# Altium schematic sheet PAGE1 - CONTENTS.SchDoc
size A3
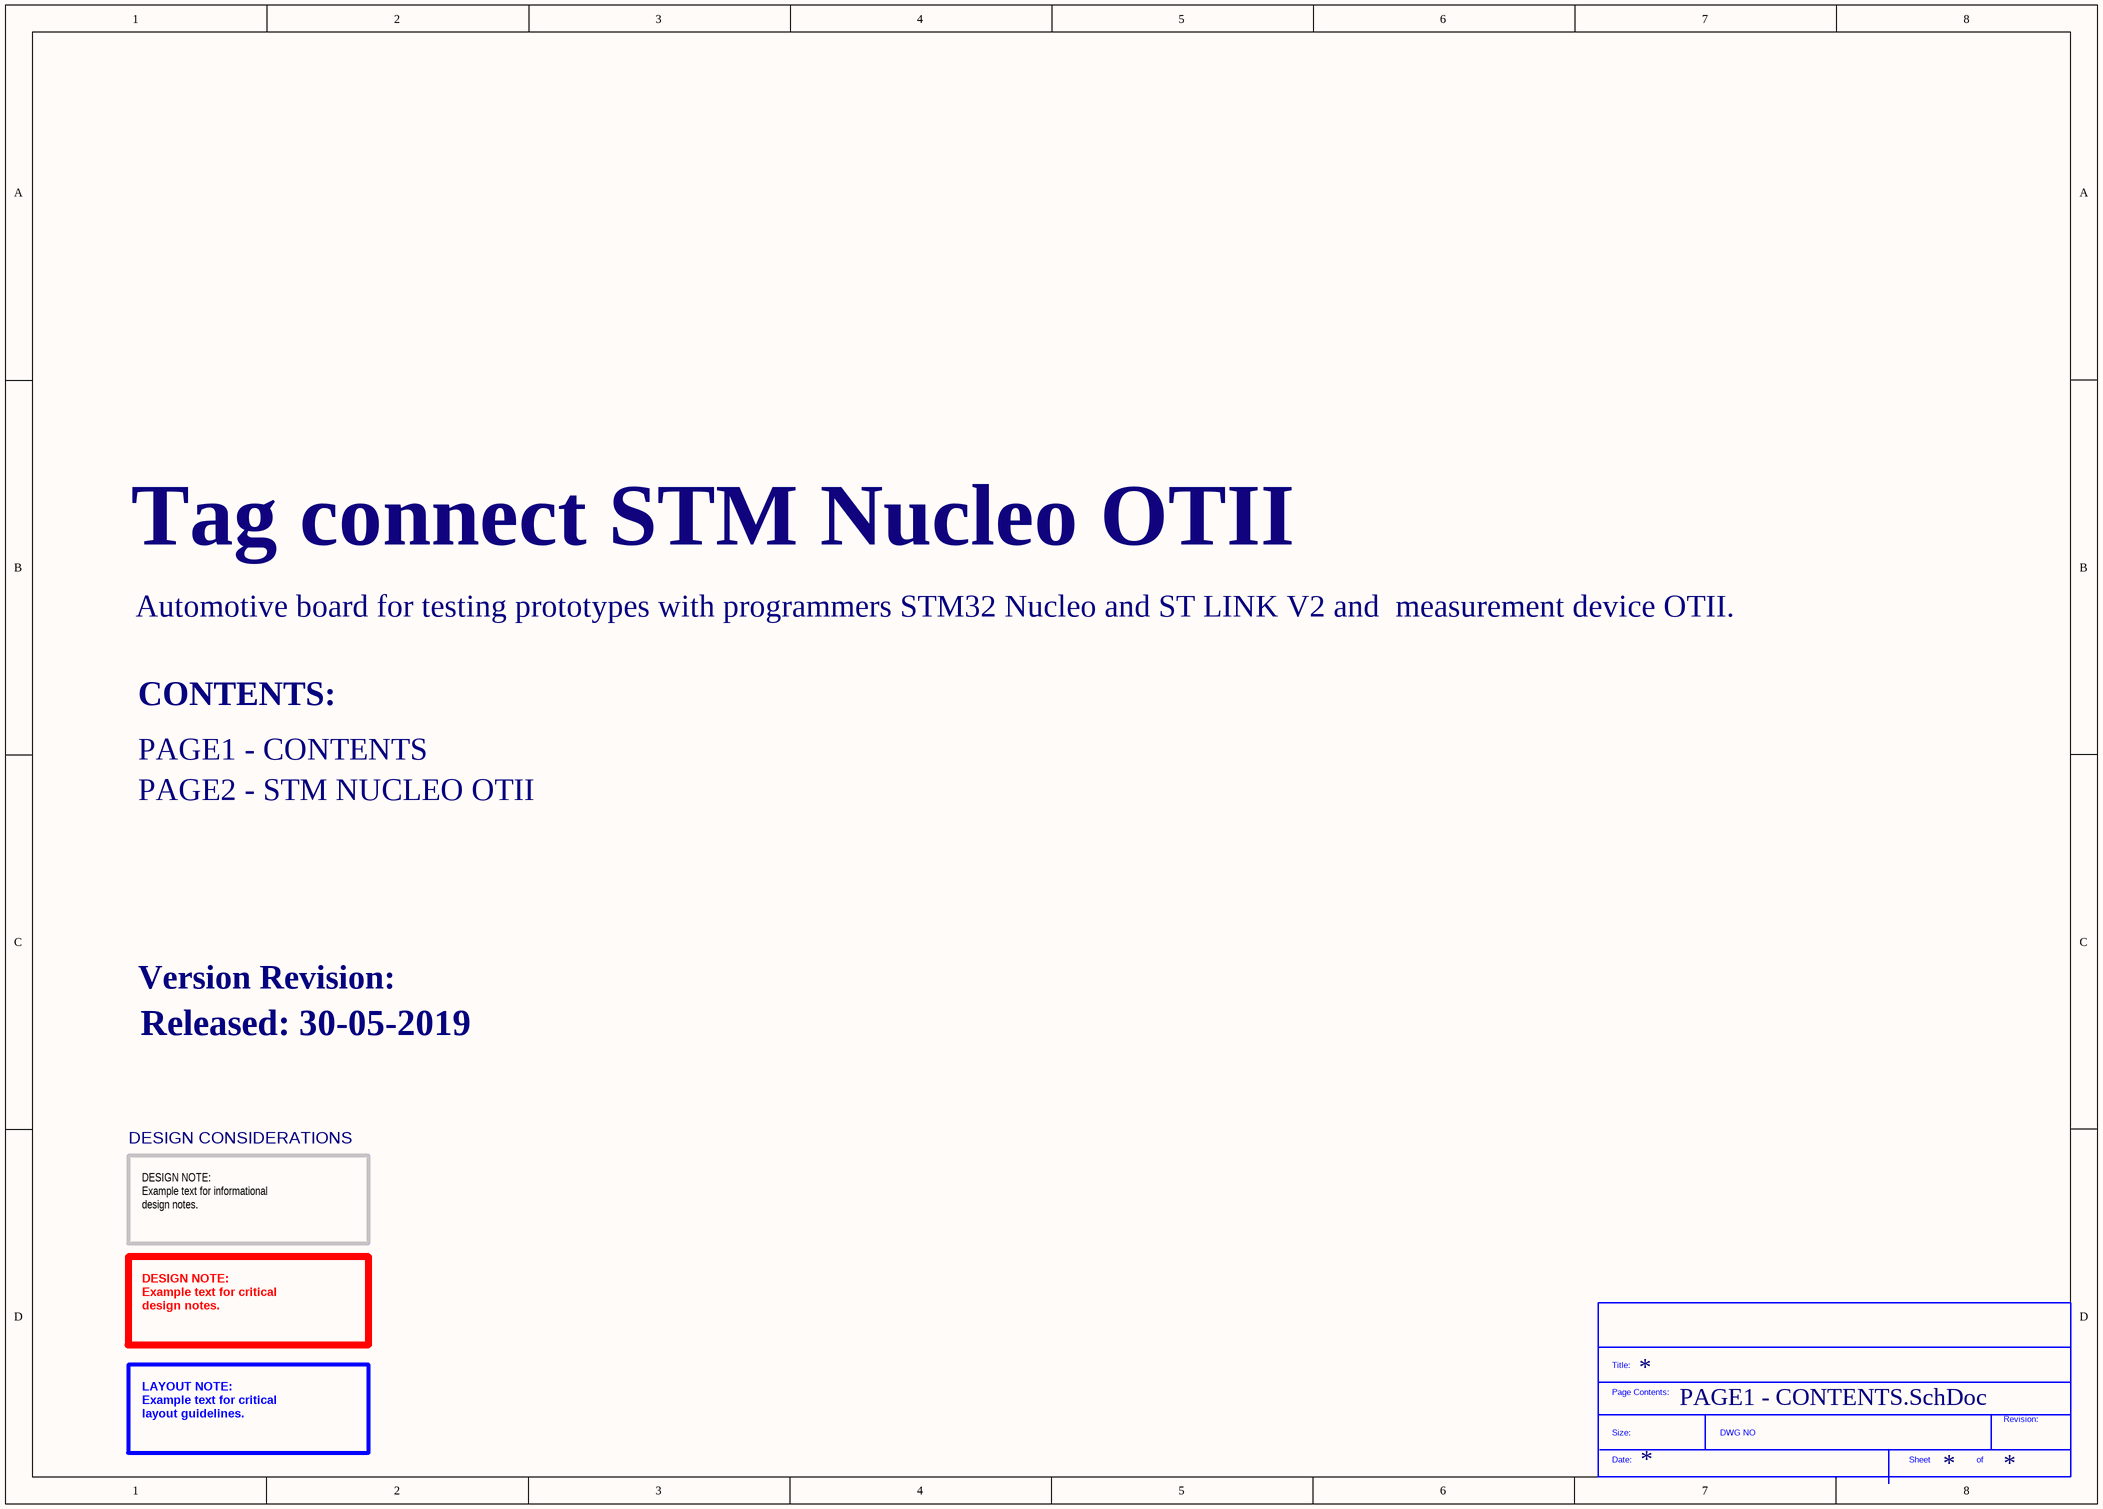
[diagram p0: PAGE1 - CONTENTS.SchDoc]

## Parts
*?  SDTitleBlock  (value not drawn)  (graphical)

## Notes on the sheet
- Tag connect STM Nucleo OTII
- Automotive board for testing prototypes with programmers STM32 Nucleo and ST LINK V2 and  measurement device OTII.
- CONTENTS:
- PAGE1 - CONTENTS
- PAGE2 - STM NUCLEO OTII
- Version Revision:
- Released: 30-05-2019
- DESIGN CONSIDERATIONS
- DESIGN NOTE:
  Example text for informational
  design notes.
- DESIGN NOTE:
  Example text for critical
  design notes.
- LAYOUT NOTE:
  Example text for critical
  layout guidelines.
- (in symbol SDTitleBlock) Title:; Page Contents:; Revision:; Size:; DWG NO; Date:; Sheet; of